# Altium schematic sheet TP_IHM_7SEG_DRIVERS.SchDoc
size A4
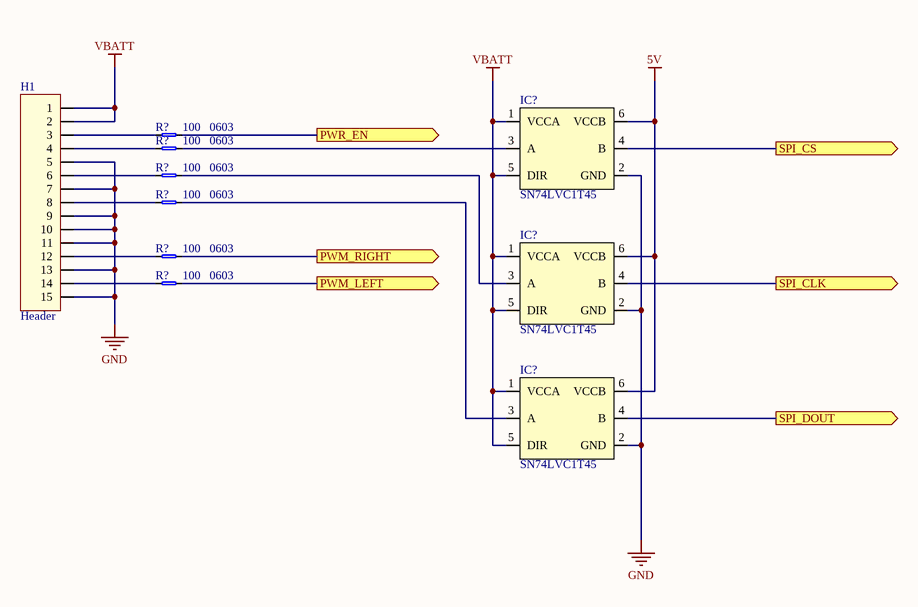
[diagram p0: TP_IHM_7SEG_DRIVERS.SchDoc]

## Parts
(Parts that share a designator on the sheet are numbered #1, #2 ... from top to bottom, then left to right.)
H1  Header  [653115131822]
IC?#1  SN74LVC1T45  [MO-203AB_LD]
IC?#2  SN74LVC1T45  [MO-203AB_LD]
IC?#3  SN74LVC1T45  [MO-203AB_LD]
R?#1  value 100  Package: 0603  [0603_RES_LD]  (hidden comment: Resistor)
R?#2  value 100  Package: 0603  [0603_RES_LD]  (hidden comment: Resistor)
R?#3  value 100  Package: 0603  [0603_RES_LD]  (hidden comment: Resistor)
R?#4  value 100  Package: 0603  [0603_RES_LD]  (hidden comment: Resistor)
R?#5  value 100  Package: 0603  [0603_RES_LD]  (hidden comment: Resistor)
R?#6  value 100  Package: 0603  [0603_RES_LD]  (hidden comment: Resistor)

## Ports
PWM_LEFT (out), PWM_RIGHT (out), PWR_EN (out), SPI_CLK (out), SPI_CS (out), SPI_DOUT (out)

## Nets
5V: IC?#1.6(VCCB) IC?#2.6(VCCB) IC?#3.6(VCCB)
GND: H1.5 H1.7 H1.9 H1.10 H1.11 H1.13 H1.15 IC?#1.2(GND) IC?#2.2(GND) IC?#3.2(GND)
VBATT: H1.1 H1.2 IC?#1.1(VCCA) IC?#1.5(DIR) IC?#2.1(VCCA) IC?#2.5(DIR) IC?#3.1(VCCA) IC?#3.5(DIR)
PWM_LEFT: R?#6.2 ; port PWM_LEFT
PWM_RIGHT: R?#5.2 ; port PWM_RIGHT
PWR_EN: R?#1.2 ; port PWR_EN
SPI_CLK: IC?#2.4(B) ; port SPI_CLK
SPI_CS: IC?#1.4(B) ; port SPI_CS
SPI_DOUT: IC?#3.4(B) ; port SPI_DOUT
NetH1_3: H1.3 R?#1.1
NetH1_4: H1.4 R?#2.1
NetH1_6: H1.6 R?#3.1
NetH1_8: H1.8 R?#4.1
NetH1_12: H1.12 R?#5.1
NetH1_14: H1.14 R?#6.1
NetIC?#1_3: IC?#1.3(A) R?#2.2
NetIC?#2_3: IC?#2.3(A) R?#3.2
NetIC?#3_3: IC?#3.3(A) R?#4.2

## Library data of the parts
H1 = HEADER_15x1: Header 15x1
IC?#1-IC?#3 = SN74LVC1T45: Single Bit Dual Supply Buffer
R?#1-R?#6 = Resistor: Precision: *